# Altium project İHA-PDU.PrjPcb (part 13 of 13)
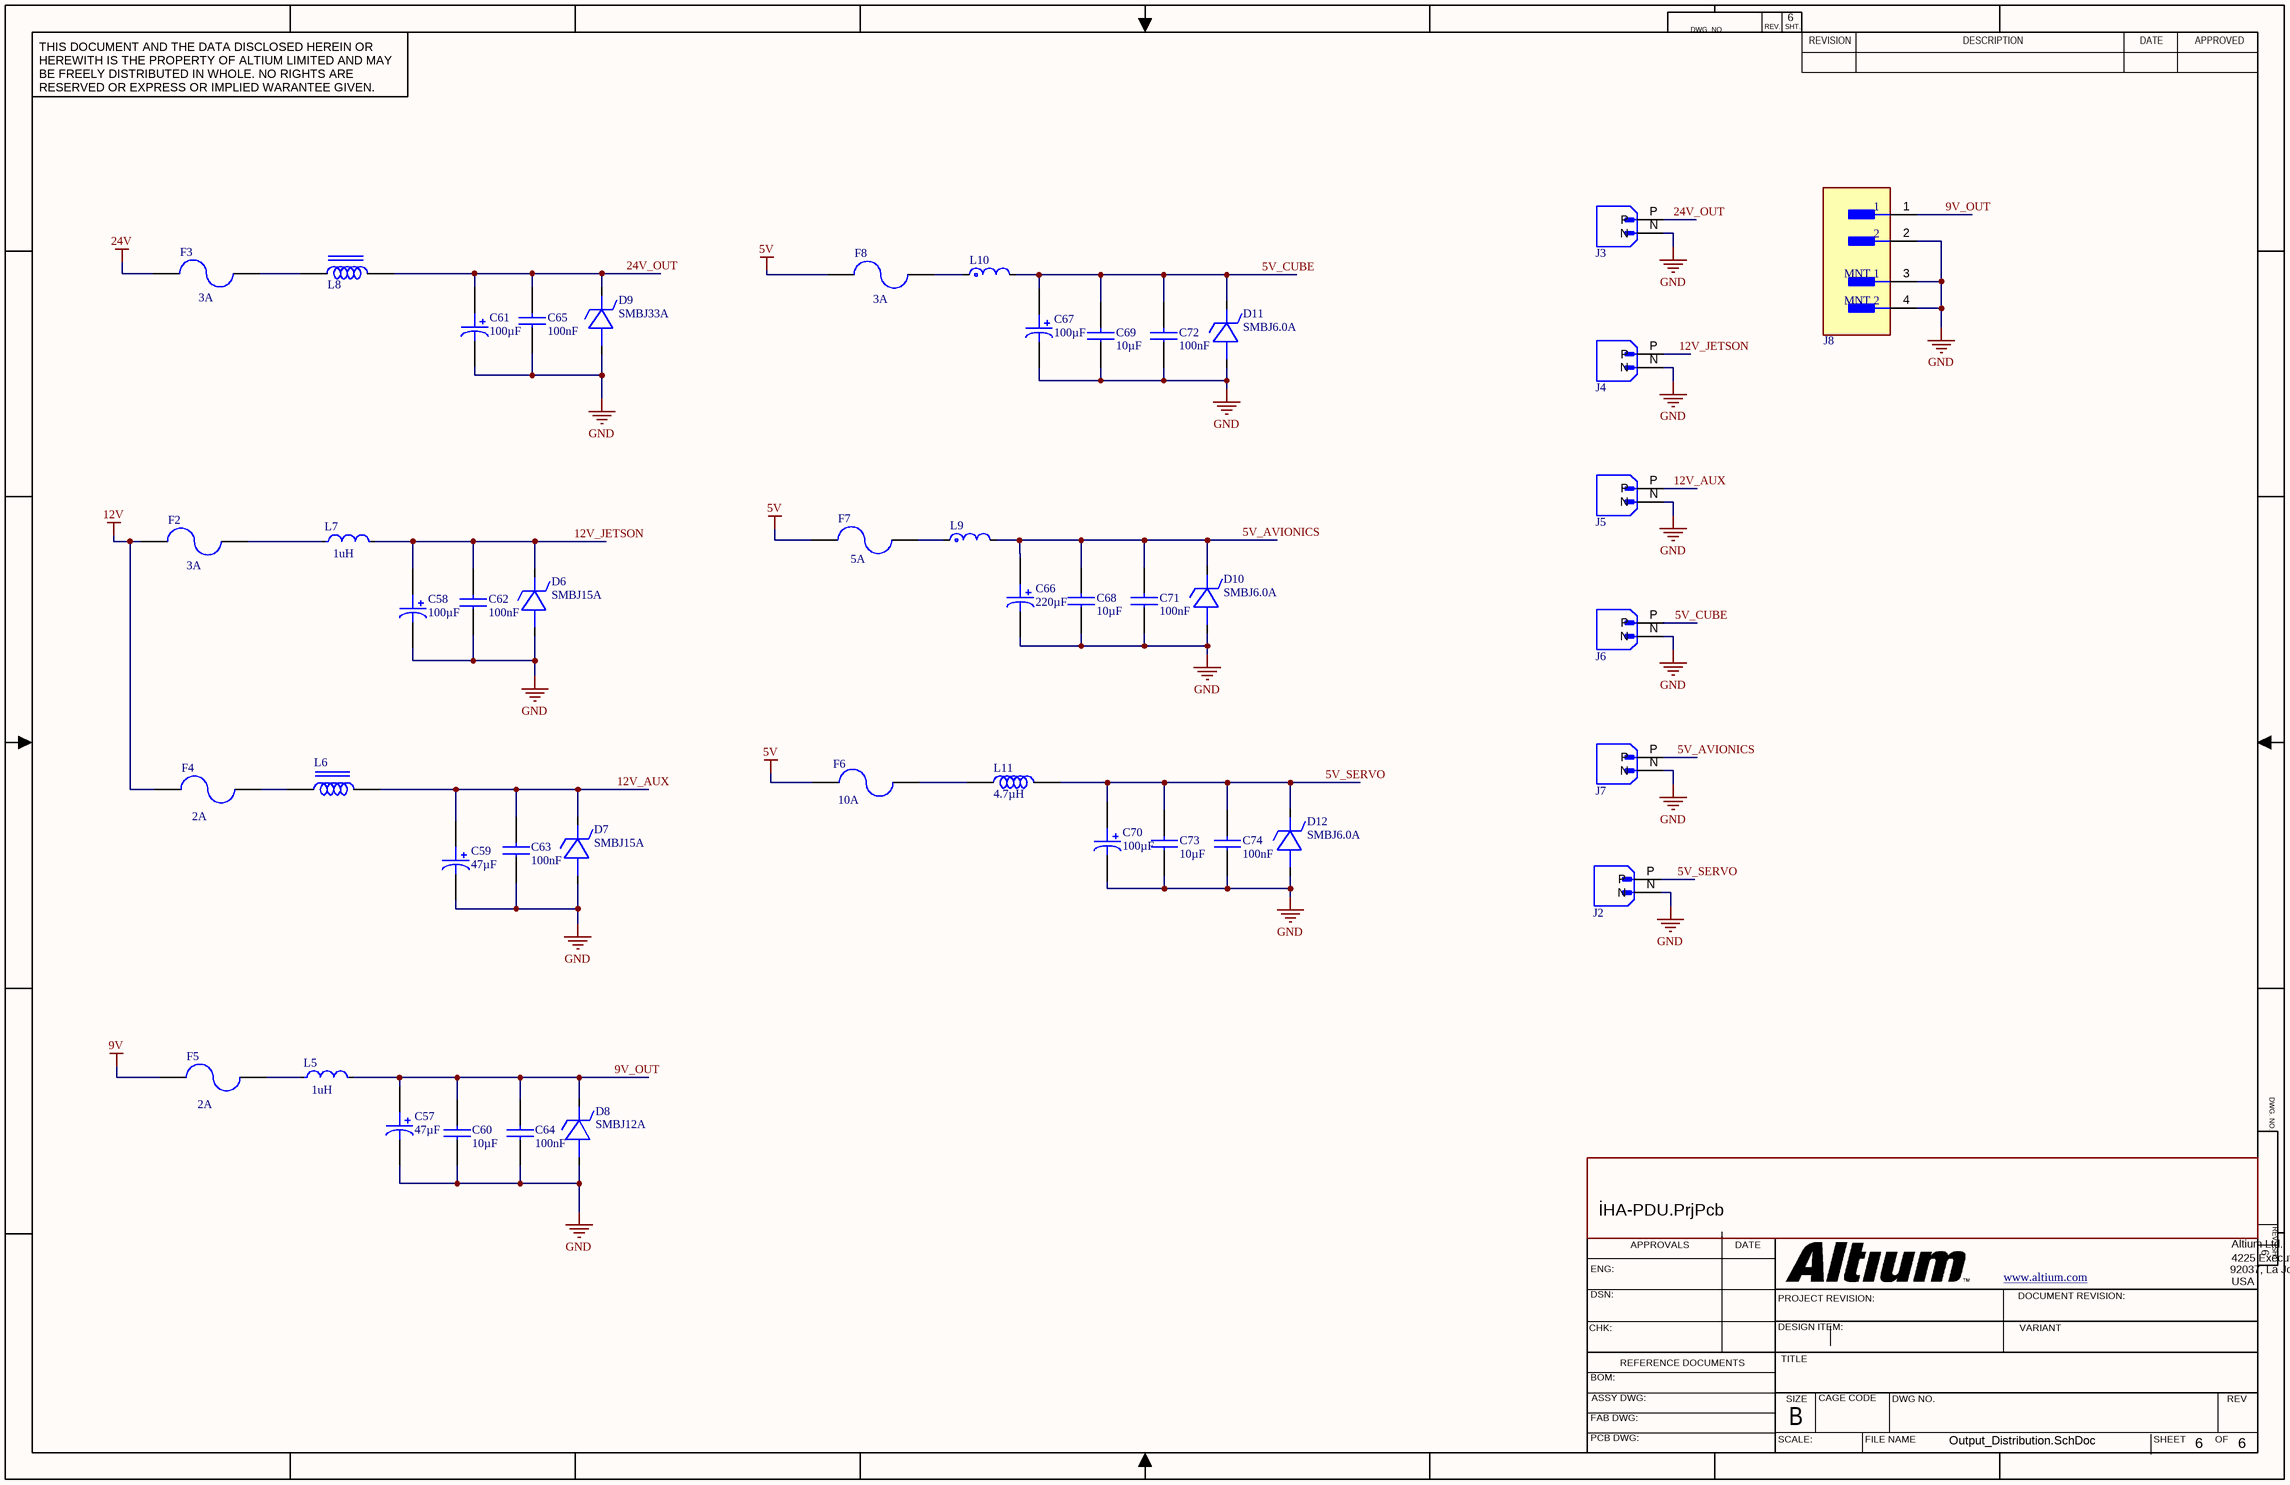
[diagram p19: Output_Distribution.SchDoc]

## Sheet Output_Distribution.SchDoc (continued)

### Library data of the parts (continued)
F7 = Littelfuse 0452005.MRL: 452 Series - NANO2®Slo-Blo®Subminiature Surface Mount Fuse, 5 A, 125 VAC 125 VDC, RoHS; Approvals: CSA, PSE, UL, UR; Body Material: Ceramic; Ratings: CE, CSA, TUV; Value: 13.6mΩ; Time to Trip: 2ms; Voltage Rating: 125V; Supplier: Farnell; Supplier Part Number: 0452005.MRL; Manufacturer: Littelfuse; Manufacturer Part Number: 0452005.MRL; RoHS: Compliant; Category: Fuses; Stock: 649; Pricing: 1=2,43, 50=1,54, 100=1,45, 250=1,28, 500=1,24 (EUR); Case/Package: SMD/SMT; China RoHS: Non-Compliant; Contact Plating: Gold; Country of Origin: Philippines; Current Rating: 5A; Depth: 2.69mm; Diameter: 2.69mm; Export Control Classification Number (ECCN) Code: EAR99; Height: 2.69mm; Housing Material: Ceramic; Harmonized Tariff Schedule (HTS) Code: 8536.10.00.40; Introduction Date: 2005-07-31; Lead Free: Lead Free; Length: 6.1mm; Lifecycle Status: Production; Max Operating Temperature: 125°C; Min Operating Temperature: -55°C; Mounting Technology: Surface Mount; Pins: 2; Radiation Hardening: No; REACH SVHC: No; Terminal Material: Gold; Termination: SMD/SMT; Voltage Rating (AC): 125V; Voltage Rating (DC): 125V; Width: 2.69mm; ComponentLink1URL: https://datasheet.octopart.com:443/0452005.MRL-Littelfuse-datasheet-150463550.pdf?src-supplier=IHS; ComponentLink1Description: https://datasheet.octopart.com:443/0452005.MRL-Littelfuse-datasheet-150463550.pdf?src-supplier=IHS; ComponentLink2URL: https://datasheet.octopart.com:443/0452005.MRL-Littelfuse-datasheet-24577142.pdf?src-supplier=Upverter; ComponentLink2Description: https://datasheet.octopart.com:443/0452005.MRL-Littelfuse-datasheet-24577142.pdf?src-supplier=Upverter; ComponentLink3URL: https://datasheet.octopart.com:443/0452005.MRL-Littelfuse-datasheet-4520.pdf?src-supplier=Farnell; ComponentLink3Description: https://datasheet.octopart.com:443/0452005.MRL-Littelfuse-datasheet-4520.pdf?src-supplier=Farnell; ComponentLink4URL: https://datasheet.octopart.com:443/0452005.MRL-Littelfuse-datasheet-65933515.pdf?src-supplier=Farnell; ComponentLink4Description: https://datasheet.octopart.com:443/0452005.MRL-Littelfuse-datasheet-65933515.pdf?src-supplier=Farnell; ComponentLink5URL: https://datasheet.octopart.com:443/0452005.MRL-Littelfuse-datasheet-71421564.pdf?src-supplier=Farnell; ComponentLink5Description: https://datasheet.octopart.com:443/0452005.MRL-Littelfuse-datasheet-71421564.pdf?src-supplier=Farnell; ComponentLink6URL: https://datasheet.octopart.com:443/0452005.MRL-Littelfuse-datasheet-520781.pdf?src-supplier=Farnell; ComponentLink6Description: https://datasheet.octopart.com:443/0452005.MRL-Littelfuse-datasheet-520781.pdf?src-supplier=Farnell; ComponentLink7URL: https://datasheet.octopart.com:443/0452005.MRL-Littelfuse-datasheet-524166.pdf?src-supplier=Farnell; ComponentLink7Description: https://datasheet.octopart.com:443/0452005.MRL-Littelfuse-datasheet-524166.pdf?src-supplier=Farnell; ComponentLink8URL: https://datasheet.octopart.com:443/0452005.MRL-Littelfuse-datasheet-22975140.pdf?src-supplier=Newark; ComponentLink8Description: https://datasheet.octopart.com:443/0452005.MRL-Littelfuse-datasheet-22975140.pdf?src-supplier=Newark; ComponentLink9URL: https://datasheet.octopart.com:443/0452005.MRL-Littelfuse-datasheet-170674127.pdf?src-supplier=JRH+Electronics; ComponentLink9Description: https://datasheet.octopart.com:443/0452005.MRL-Littelfuse-datasheet-170674127.pdf?src-supplier=JRH+Electronics; ComponentLink10URL: https://datasheet.octopart.com:443/0452005.MRL-Littelfuse-datasheet-128569235.pdf?src-supplier=ODG+(Origin+Data+Global); ComponentLink10Description: https://datasheet.octopart.com:443/0452005.MRL-Littelfuse-datasheet-128569235.pdf?src-supplier=ODG+(Origin+Data+Global); ComponentLink11URL: https://datasheet.octopart.com:443/0452005.MRL-Littelfuse-datasheet-41168772.pdf?src-supplier=element14+APAC; ComponentLink11Description: https://datasheet.octopart.com:443/0452005.MRL-Littelfuse-datasheet-41168772.pdf?src-supplier=element14+APAC; ComponentLink12URL: https://datasheet.octopart.com:443/0452005.MRL-Littelfuse-datasheet-17291148.pdf?src-supplier=Burklin+Elektronik; ComponentLink12Description: https://datasheet.octopart.com:443/0452005.MRL-Littelfuse-datasheet-17291148.pdf?src-supplier=Burklin+Elektronik; ComponentLink13URL: https://datasheet.octopart.com:443/0452005.MRL-Littelfuse-datasheet-11544861.pdf?src-supplier=TME; ComponentLink13Description: https://datasheet.octopart.com:443/0452005.MRL-Littelfuse-datasheet-11544861.pdf?src-supplier=TME; ComponentLink14URL: https://datasheet.octopart.com:443/0452005.MRL-Littelfuse-datasheet-9634991.pdf?src-supplier=RS+(Formerly+Allied+Electronics); ComponentLink14Description: https://datasheet.octopart.com:443/0452005.MRL-Littelfuse-datasheet-9634991.pdf?src-supplier=RS+(Formerly+Allied+Electronics)
J2-J7 = XT30PW-M: Socket; DC supply; XT30; male; PIN: 2; on PCBs; THT; Colour: yellow
J8 = SM02B-GHS-TB: MCU 32-bit LPC1800 ARM Cortex M3 RISC 768KB Flash 3.3V 100-Pin TFBGA Tray; Manufacturer: JST; Manufacturer Part Number: SM02B-GHS-TB(LF)(SN); Connector Type: Male Pin, Outer Shroud Contact; Contact Resistance: 50mΩ; Current Rating: 1A; Dielectric Material: Polyamide; Gender: Male; Insulation Resistance: 100MΩ; Number of Contacts: 2; Pitch: 1.2446mm; Voltage Rating: 50V; Supplier: Future Electronics; Supplier Part Number: SM02B-GHS-TB(LF)(SN); RoHS: Compliant; Category: Headers and Wire Housings; Stock: 7500; Pricing: 2500=0,162, 5000=0,16, 7500=0,159, 10000=0,158, 12500=0,156 (USD); China RoHS: Compliant; Color: Natural; Contact Material: Copper, Tin; Contact Plating: Tin; Country of Origin: Japan; Export Control Classification Number (ECCN) Code: EAR99; Fastening Type: Latch, Ramp; Height: 4.25mm; Housing Color: Natural; Housing Material: Nylon; Harmonized Tariff Schedule (HTS) Code: 8536.69.40.40; Introduction Date: 2005-03-29; Lead Free: Lead Free; Lifecycle Status: Production; Max Operating Temperature: 85°C; Min Operating Temperature: -25°C; Mounting Technology: Surface Mount; Pins: 2; Number of Positions: 2; Number of Rows: 1; REACH SVHC: Yes; Terminal Pitch: 1.25mm; Termination: Solder; ComponentLink1URL: https://datasheet.octopart.com:443/SM02B-GHS-TB%28LF%29%28SN%29-JST-datasheet-151632282.pdf?src-supplier=Upverter; ComponentLink1Description: https://datasheet.octopart.com:443/SM02B-GHS-TB%28LF%29%28SN%29-JST-datasheet-151632282.pdf?src-supplier=Upverter; ComponentLink2URL: https://datasheet.octopart.com:443/SM02B-GHS-TB%28LF%29%28SN%29-JST-datasheet-10511.pdf?src-supplier=Farnell; ComponentLink2Description: https://datasheet.octopart.com:443/SM02B-GHS-TB%28LF%29%28SN%29-JST-datasheet-10511.pdf?src-supplier=Farnell; ComponentLink3URL: https://datasheet.octopart.com:443/SM02B-GHS-TB-%28LF%29%28SN%29-JST-datasheet-28358378.pdf?src-supplier=TME; ComponentLink3Description: https://datasheet.octopart.com:443/SM02B-GHS-TB-%28LF%29%28SN%29-JST-datasheet-28358378.pdf?src-supplier=TME; ComponentLink4URL: https://datasheet.octopart.com:443/SM02B-GHS-TB%28LF%29%28SN%29-JST-datasheet-13551083.pdf?src-supplier=Future+Electronics; ComponentLink4Description: https://datasheet.octopart.com:443/SM02B-GHS-TB%28LF%29%28SN%29-JST-datasheet-13551083.pdf?src-supplier=Future+Electronics; ComponentLink5URL: https://datasheet.octopart.com:443/SM02B-GHS-TB%28LF%29%28SN%29-JST-datasheet-12527556.pdf?src-supplier=Future+Electronics; ComponentLink5Description: https://datasheet.octopart.com:443/SM02B-GHS-TB%28LF%29%28SN%29-JST-datasheet-12527556.pdf?src-supplier=Future+Electronics; ComponentLink6URL: https://datasheet.octopart.com:443/SM02B-GHS-TB%28LF%29%28SN%29-JST-datasheet-137194309.pdf?src-supplier=Component+Distributors+Inc.; ComponentLink6Description: https://datasheet.octopart.com:443/SM02B-GHS-TB%28LF%29%28SN%29-JST-datasheet-137194309.pdf?src-supplier=Component+Distributors+Inc.
L5 L7 = CMP-11268-000037-1: Fixed Inductors 1uH 20% 9.6A 14.60mOhms AEC-Q200; Manufacturer: Coilcraft; Saturation Current: 8.7A; Core Material: Composite; Test Frequency: 1MHz; Standoff Height: 0.1mm; Shielding: true; Automotive Grade: Grade 1; Self Resonant Frequency: 79MHz; Series Resistance: 14.6mΩ; Rms Current: 9.6A; Category: Ind; RoHS: TRUE; Device Class L2: Inductors; Mouser Description: Power inductor, shielded, 20% tol, SMT, RoHS, halogen f; Lead Free: Yes; Device Class L1: Passive Components; Inductance: 1uH; ComponentLink2URL: https://www.coilcraft.com/pdfs/xal4000.pdf; Height: 2.1mm; Device Class L3: Fixed Inductors; Composition: Wirewound; Package: 0; Ambient Temperature Range Low: -40°C; Automotive: Yes; Ambient Temperature Range High: +125°C; ComponentLink2Description: Datasheet; Octopart: https://octopart.com/xal4020-102mec-coilcraft-13142161; Tolerance: 20%; Manufacturer Part Number: XAL4020-102MEC
L6 = BLM31PG601SN1L: Ferrite Beads Multi-Layer 600Ohm 25% 100MHz 1.5A 80mOhm DCR 1206 Embossed T/R; Manufacturer: Murata; Current Rating: 1A; DC Resistance (DCR): 80mΩ; Impedance: 600Ω; Material: Ceramic; Number of Circuits: 1; Value: 90mΩ; Shielding: Unshielded; Supplier: Farnell; Supplier Part Number: BLM31PG601SN1L; Manufacturer Part Number: BLM31PG601SN1L; RoHS: Compliant; Category: Ferrite Beads and Chips; Stock: 54560; Pricing: 5=0,287, 50=0,159, 250=0,121, 500=0,106, 1500=0,0755, 3000=0,074 (EUR); Case/Package: 1206; Case Code (Imperial): 1206; Case Code (Metric): 3216; Contact Plating: Tin; Core Material: Ferrite; Country of Origin: Japan; DC Current: 1.5A; Depth: 1.6mm; Export Control Classification Number (ECCN) Code: EAR99; Frequency: 100MHz; Height: 1.1mm; Harmonized Tariff Schedule (HTS) Code: 8504.50.80.00; Introduction Date: 2001-06-01; Lead Free: Lead Free; Length: 3.2mm; Lifecycle Status: Production; Max Current Rating: 1.5A; Max DC Current: 1.5A; Clock Frequency: 100MHz; Max Operating Temperature: 125°C; Military Standard: Not; Min Operating Temperature: -55°C; Mounting Technology: Surface Mount; Number of Lines: 1; Number of Terminals: 2; Packaging: Tape and Reel; Radiation Hardening: No; REACH SVHC: Yes; RMS Current (Irms): 1.5A; Saturation Current: 1.5A; Schedule B: 8504500000, 8504500000|8504500000|8504500000|8504500000|8504500000; ESR: 80mΩ; Termination: SMD/SMT; Test Frequency: 100MHz; Tolerance: 25%; Weight: 10.007382mg; Width: 1.6mm; ComponentLink1URL: https://datasheet.octopart.com:443/BLM31PG601SN1L-Murata-datasheet-180807193.pdf?src-supplier=Farnell; ComponentLink1Description: https://datasheet.octopart.com:443/BLM31PG601SN1L-Murata-datasheet-180807193.pdf?src-supplier=Farnell; ComponentLink2URL: https://datasheet.octopart.com:443/BLM31PG601SN1L-Murata-datasheet-11030792.pdf?src-supplier=Farnell; ComponentLink2Description: https://datasheet.octopart.com:443/BLM31PG601SN1L-Murata-datasheet-11030792.pdf?src-supplier=Farnell; ComponentLink3URL: https://datasheet.octopart.com:443/BLM31PG601SN1L-Murata-datasheet-138896903.pdf?src-supplier=Upverter; ComponentLink3Description: https://datasheet.octopart.com:443/BLM31PG601SN1L-Murata-datasheet-138896903.pdf?src-supplier=Upverter; ComponentLink4URL: https://datasheet.octopart.com:443/BLM31PG601SN1L-Murata-datasheet-12522583.pdf?src-supplier=Upverter; ComponentLink4Description: https://datasheet.octopart.com:443/BLM31PG601SN1L-Murata-datasheet-12522583.pdf?src-supplier=Upverter; ComponentLink5URL: https://datasheet.octopart.com:443/BLM31PG601SN1L-Murata-datasheet-10083551.pdf?src-supplier=Upverter; ComponentLink5Description: https://datasheet.octopart.com:443/BLM31PG601SN1L-Murata-datasheet-10083551.pdf?src-supplier=Upverter; ComponentLink6URL: https://datasheet.octopart.com:443/BLM31PG601SN1L-Murata-datasheet-8508678.pdf?src-supplier=Upverter; ComponentLink6Description: https://datasheet.octopart.com:443/BLM31PG601SN1L-Murata-datasheet-8508678.pdf?src-supplier=Upverter; ComponentLink7URL: https://datasheet.octopart.com:443/BLM31PG601SN1L-Murata-datasheet-67835415.pdf?src-supplier=element14+APAC; ComponentLink7Description: https://datasheet.octopart.com:443/BLM31PG601SN1L-Murata-datasheet-67835415.pdf?src-supplier=element14+APAC; ComponentLink8URL: https://datasheet.octopart.com:443/BLM31PG601SN1L-Murata-datasheet-8377030.pdf?src-supplier=_legacy+Avnet; ComponentLink8Description: https://datasheet.octopart.com:443/BLM31PG601SN1L-Murata-datasheet-8377030.pdf?src-supplier=_legacy+Avnet; ComponentLink9URL: https://datasheet.octopart.com:443/BLM31PG601SN1L-Murata-datasheet-584344.pdf?src-supplier=_legacy+Avnet; ComponentLink9Description: https://datasheet.octopart.com:443/BLM31PG601SN1L-Murata-datasheet-584344.pdf?src-supplier=_legacy+Avnet; ComponentLink10URL: https://datasheet.octopart.com:443/BLM31PG601SN1L-Murata-datasheet-25069.pdf?src-supplier=TME; ComponentLink10Description: https://datasheet.octopart.com:443/BLM31PG601SN1L-Murata-datasheet-25069.pdf?src-supplier=TME; ComponentLink11URL: https://datasheet.octopart.com:443/BLM31PG601SN1L-Murata-datasheet-155367988.pdf?src-supplier=TME; ComponentLink11Description: https://datasheet.octopart.com:443/BLM31PG601SN1L-Murata-datasheet-155367988.pdf?src-supplier=TME; ComponentLink12URL: https://datasheet.octopart.com:443/BLM31PG601SN1L-Murata-datasheet-141258135.pdf?src-supplier=Ciiva; ComponentLink12Description: https://datasheet.octopart.com:443/BLM31PG601SN1L-Murata-datasheet-141258135.pdf?src-supplier=Ciiva; ComponentLink13URL: https://datasheet.octopart.com:443/BLM31PG601SN1L-Murata-datasheet-138707549.pdf?src-supplier=Ciiva; ComponentLink13Description: https://datasheet.octopart.com:443/BLM31PG601SN1L-Murata-datasheet-138707549.pdf?src-supplier=Ciiva; ComponentLink14URL: https://datasheet.octopart.com:443/BLM31PG601SN1L-Murata-datasheet-78375072.pdf?src-supplier=Future+Electronics; ComponentLink14Description: https://datasheet.octopart.com:443/BLM31PG601SN1L-Murata-datasheet-78375072.pdf?src-supplier=Future+Electronics; ComponentLink15URL: https://datasheet.octopart.com:443/BLM31PG601SN1L-Murata-datasheet-62086394.pdf?src-supplier=Future+Electronics; ComponentLink15Description: https://datasheet.octopart.com:443/BLM31PG601SN1L-Murata-datasheet-62086394.pdf?src-supplier=Future+Electronics; ComponentLink16URL: https://datasheet.octopart.com/BLM31PG601SN1L-Murata-datasheet-37129980.pdf; ComponentLink16Description: https://datasheet.octopart.com/BLM31PG601SN1L-Murata-datasheet-37129980.pdf; ComponentLink17URL: https://datasheet.octopart.com:443/BLM31PG601SN1L-Murata-datasheet-13563506.pdf?src-supplier=Factory+Futures; ComponentLink17Description: https://datasheet.octopart.com:443/BLM31PG601SN1L-Murata-datasheet-13563506.pdf?src-supplier=Factory+Futures; ComponentLink18URL: https://datasheet.octopart.com:443/BLM31PG601SN1L-Murata-datasheet-12545319.pdf?src-supplier=Factory+Futures; ComponentLink18Description: https://datasheet.octopart.com:443/BLM31PG601SN1L-Murata-datasheet-12545319.pdf?src-supplier=Factory+Futures; ComponentLink19URL: https://datasheet.octopart.com:443/BLM31PG601SN1L-Murata-datasheet-14066397.pdf?src-supplier=iiiC; ComponentLink19Description: https://datasheet.octopart.com:443/BLM31PG601SN1L-Murata-datasheet-14066397.pdf?src-supplier=iiiC; ComponentLink20URL: https://datasheet.octopart.com:443/BLM31PG601SN1L-Murata-datasheet-11771989.pdf?src-supplier=Arrow+Electronics; ComponentLink20Description: https://datasheet.octopart.com:443/BLM31PG601SN1L-Murata-datasheet-11771989.pdf?src-supplier=Arrow+Electronics; ComponentLink21URL: https://datasheet.octopart.com:443/BLM31PG601SN1L-Murata-datasheet-7593909.pdf?src-supplier=Jameco; ComponentLink21Description: https://datasheet.octopart.com:443/BLM31PG601SN1L-Murata-datasheet-7593909.pdf?src-supplier=Jameco; ComponentLink22URL: https://datasheet.octopart.com:443/BLM31PG601SN1L-Murata-datasheet-1584.pdf?src-supplier=RS+(Formerly+Allied+Electronics); ComponentLink22Description: https://datasheet.octopart.com:443/BLM31PG601SN1L-Murata-datasheet-1584.pdf?src-supplier=RS+(Formerly+Allied+Electronics); ComponentLink23URL: http://sigma.octopart.com:80/reach_statement/Murata-company-16.pdf?src-supplier=Compliance+Statements; ComponentLink23Description: http://sigma.octopart.com:80/reach_statement/Murata-company-16.pdf?src-supplier=Compliance+Statements
L8 = BLM31SN500SH1L: Ferrite Beads Multi-Layer Power 50Ohm 25% 100MHz 12A 0.0016Ohm DCR 1206 Automotive T/R; Manufacturer: Murata; Current Rating: 10A; DC Resistance (DCR): 1.6mΩ; Impedance: 50Ω; Number of Circuits: 1; Value: 1.6mΩ; Supplier: Farnell; Supplier Part Number: BLM31SN500SH1L; Manufacturer Part Number: BLM31SN500SH1L; RoHS: Compliant; Category: Ferrite Beads and Chips; Stock: 12452; Pricing: 5=0,411, 50=0,221, 250=0,167, 500=0,147, 1500=0,111, 3000=0,109 (EUR); Case/Package: 1206; Case Code (Imperial): 1206; Case Code (Metric): 3216; Contact Plating: Tin; Core Material: Ferrite; Height: 1.1mm; Length: 3.2mm; Lifecycle Status: Production; Max Current Rating: 12A; Max Operating Temperature: 125°C; Min Operating Temperature: -55°C; Mounting Technology: Surface Mount; Number of Lines: 1; Number of Terminals: 2; Ratings: AEC-Q200; REACH SVHC: Yes; RMS Current (Irms): 12A; Schedule B: 8504500000, 8504500000|8504500000|8504500000|8504500000|8504500000|8504500000|8504500000|8504500000|8504500000|8504500000|8504500000|8504500000|8504500000|8504500000, 8504500000|8504500000|8504500000|8504500000|8504500000|8504500000|8504500000|8504500000|8504500000|8504500000|8504500000|8504500000|8504500000|8504500000|8504500000|8504500000|8504500000|8504500000|8504500000|8504500000|8504500000|8504500000|8504500000|85; ESR: 1.6mΩ; Test Frequency: 100MHz; Tolerance: 25%; Width: 1.6mm; ComponentLink1URL: https://datasheet.octopart.com:443/BLM31SN500SH1L-Murata-datasheet-180807211.pdf?src-supplier=IHS; ComponentLink1Description: https://datasheet.octopart.com:443/BLM31SN500SH1L-Murata-datasheet-180807211.pdf?src-supplier=IHS; ComponentLink2URL: https://datasheet.octopart.com:443/BLM31SN500SH1L-Murata-datasheet-141273701.pdf?src-supplier=element14+APAC; ComponentLink2Description: https://datasheet.octopart.com:443/BLM31SN500SH1L-Murata-datasheet-141273701.pdf?src-supplier=element14+APAC; ComponentLink3URL: https://datasheet.octopart.com:443/BLM31SN500SH1L-Murata-datasheet-138707554.pdf?src-supplier=Ciiva; ComponentLink3Description: https://datasheet.octopart.com:443/BLM31SN500SH1L-Murata-datasheet-138707554.pdf?src-supplier=Ciiva; ComponentLink4URL: https://datasheet.octopart.com:443/BLM31SN500SH1L-Murata-datasheet-102761985.pdf?src-supplier=Future+Electronics; ComponentLink4Description: https://datasheet.octopart.com:443/BLM31SN500SH1L-Murata-datasheet-102761985.pdf?src-supplier=Future+Electronics; ComponentLink5URL: http://sigma.octopart.com:80/reach_statement/Murata-company-16.pdf?src-supplier=Compliance+Statements; ComponentLink5Description: http://sigma.octopart.com:80/reach_statement/Murata-company-16.pdf?src-supplier=Compliance+Statements
L9 L10 = CMP-11268-000158-1: Fixed Inductors 2.2uH Shld 20% 9.2A 14.5mOhms AECQ2 SRF: 38MHz Test Freq: 1MHz; Test Frequency: 100kHz; Core Material: Composite; Shielding: Shielded; DC Resistance (DCR): 14.5mR; RMS Current (Irms): 9.7A; Max Operating Temperature: 125°C; Self Resonant Frequency: 38MHz; Package Quantity: 400; Min Operating Temperature: -40°C; Width: 5.48mm; Series: XAL5030; Inductance: 2.2uH; Length: 5.68mm; RoHS Compliant: Yes; Termination: SMD/SMT; Packaging: Tape and Reel; Max DC Current: 9.2A; Saturation Current: 9.2A; Lead Free: Contains Lead; Mount: Surface Mount; Case/Package: SMD/SMT; Height: 3.1mm; Inductance Tolerance: 20%; Tolerance: 20%
L11 = XAL6060-472MEB: Güç İndüktörleri - SMD 4.7uH Shld 20% 11A 14.4mOhms AECQ2; Manufacturer: Coilcraft; Core Material: Composite; DC Resistance (DCR): 14.4mΩ; Number of Circuits: 1; Self Resonant Frequency: 21MHz; Shielding: Shielded; Test Frequency: 1MHz; Category: Fixed Inductors; Country of Origin: Indonesia, Mainland China, Vietnam; Export Control Classification Number (ECCN) Code: EAR99; Harmonized Tariff Schedule (HTS) Code: 8504.50.80.00; Height: 6.1mm; Introduction Date: 2011-03-29; Lead Free: Contains Lead; Length: 6.56mm; Lifecycle Status: Obsolete; LTB Date: 2021-03-01; LTD Date: 2021-03-01; Manufacturer Part Number: XAL6060-472MEB; Max Current Rating: 11A; Max DC Current: 11A; Max Operating Temperature: 125°C; Min Operating Temperature: -40°C; Number of Terminals: 2; Ratings: AEC-Q200; REACH SVHC: Yes; RoHS: Compliant; Termination: SMD/SMT; Tolerance: 20%; Width: 6.36mm

## Nets that join several sheets
5V: 5V_Power_Stage (7 pins), Output_Distribution (F6.1 F7.1 F8.1)
9V: 12V_9V_Power_Stage (8 pins), Output_Distribution (F5.1)
12V: 12V_9V_Power_Stage (7 pins), Output_Distribution (F2.1 F4.1)
24V: 24V_Main_Regulator (7 pins), 12V_9V_Power_Stage (9 pins), 5V_Power_Stage (C44.1 C45.2 Q8.5-6-7-8 U4.12), Output_Distribution (F3.1)
AGND: 24V_Main_Regulator (12 pins), 12V_9V_Power_Stage (5 pins), 5V_Power_Stage (7 pins)
GND: Input_Protection (7 pins), 24V_Main_Regulator (15 pins), 12V_9V_Power_Stage (23 pins), 5V_Power_Stage (15 pins), Output_Distribution (34 pins)
MAIN_VIN: Input_Protection (6 pins), 24V_Main_Regulator (6 pins)